# EAGLE schematic Mic to pi entire design without pinouts (EAGLE 9.6.2)
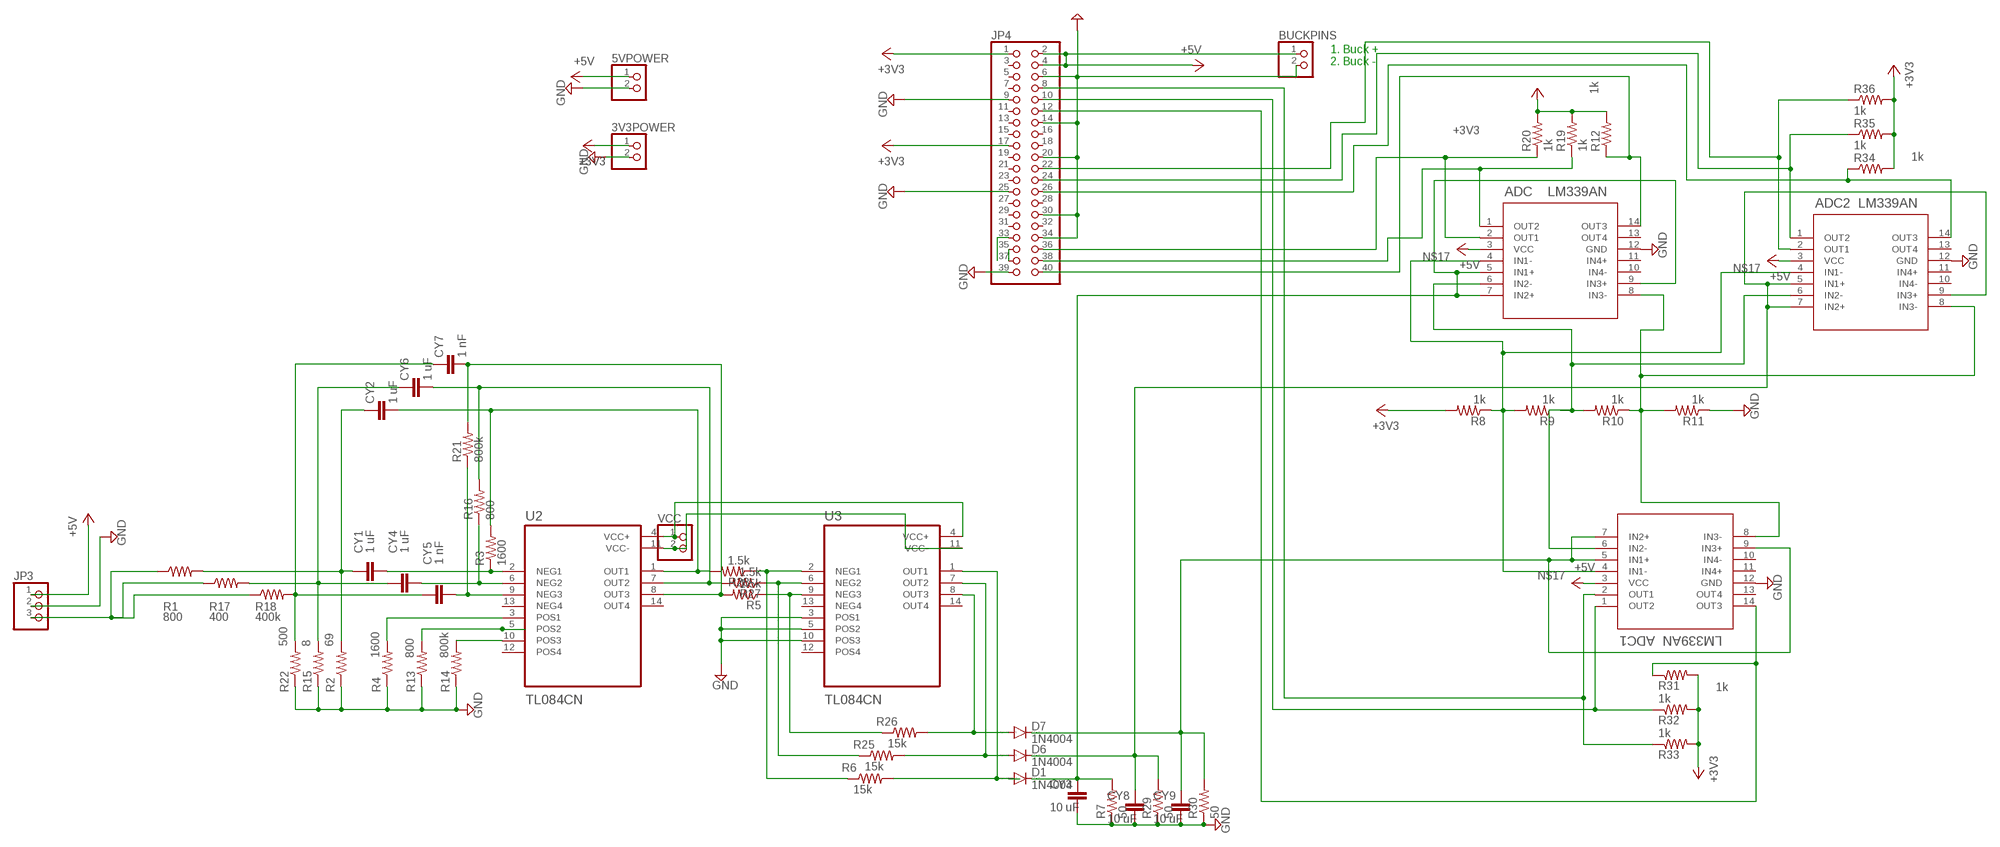
[diagram p0: schematic, sheet 1]

## Parts
3V3POWER  PINHD-1X2  [1X02]
5VPOWER  PINHD-1X2  [1X02]
ADC  LM339AN  [PDIP14_646-06_ONS]
ADC1  LM339AN  [PDIP14_646-06_ONS]
ADC2  LM339AN  [PDIP14_646-06_ONS]
BUCKPINS  PINHD-1X2  [1X02]
CY1  1 uF  CYYC7B5  [YC7B5]
CY2  1 uF  CYYC7B5  [YC7B5]
CY3  10 uF  CYYC7B5  [YC7B5]
CY4  1 uF  CYYC7B5  [YC7B5]
CY5  1 nF  CYYC7B5  [YC7B5]
CY6  1 uF  CYYC7B5  [YC7B5]
CY7  1 nF  CYYC7B5  [YC7B5]
CY8  10 uF  CYYC7B5  [YC7B5]
CY9  10 uF  CYYC7B5  [YC7B5]
D1  1N4004  [DO41-10]
D6  1N4004  [DO41-10]
D7  1N4004  [DO41-10]
JP3  PINHD-1X3  [1X03]
JP4  PINHD-2X20  [2X20]
R1  800  R-US_0204/7  [0204/7]
R2  69  R-US_0204/7  [0204/7]
R3  1600  R-US_0204/7  [0204/7]
R4  1600  R-US_0204/7  [0204/7]
R5  1.5k  R-US_0204/7  [0204/7]
R6  15k  R-US_0204/7  [0204/7]
R7  50  R-US_0204/7  [0204/7]
R8  1k  R-US_0204/7  [0204/7]
R9  1k  R-US_0207/2V  [0207/2V]
R10  1k  R-US_0207/2V  [0207/2V]
R11  1k  R-US_0207/2V  [0207/2V]
R12  1k  R-US_0207/2V  [0207/2V]
R13  800  R-US_0204/7  [0204/7]
R14  800k  R-US_0204/7  [0204/7]
R15  8  R-US_0204/7  [0204/7]
R16  800  R-US_0204/7  [0204/7]
R17  400  R-US_0204/7  [0204/7]
R18  400k  R-US_0204/7  [0204/7]
R19  1k  R-US_0204/7  [0204/7]
R20  1k  R-US_0204/7  [0204/7]
R21  800k  R-US_0204/7  [0204/7]
R22  500  R-US_0204/7  [0204/7]
R25  15k  R-US_0204/7  [0204/7]
R26  15k  R-US_0204/7  [0204/7]
R27  1.5k  R-US_0204/7  [0204/7]
R28  1.5k  R-US_0204/7  [0204/7]
R29  50  R-US_0204/7  [0204/7]
R30  50  R-US_0204/7  [0204/7]
R31  1k  R-US_0207/2V  [0207/2V]
R32  1k  R-US_0204/7  [0204/7]
R33  1k  R-US_0204/7  [0204/7]
R34  1k  R-US_0207/2V  [0207/2V]
R35  1k  R-US_0204/7  [0204/7]
R36  1k  R-US_0204/7  [0204/7]
U2  TL084CN  [DIP794W45P254L1969H508Q14]
U3  TL084CN  [DIP794W45P254L1969H508Q14]
VCC  PINHD-1X2  [1X02]

## Nets
+3V3: 3V3POWER.1 JP4.1 JP4.17 R8.2 R12.2 R19.2 R20.2 R31.2 R32.2 R33.2 R34.2 R35.2 R36.2
+5V: 5VPOWER.1 ADC1.3(VCC) ADC2.3(VCC) ADC.3(VCC) BUCKPINS.1 JP3.1 JP4.2 JP4.4
GND: 3V3POWER.2 5VPOWER.2 ADC1.12(GND) ADC2.12(GND) ADC.12(GND) BUCKPINS.2 CY3.2 CY8.2 CY9.2 JP3.2 JP4.6 JP4.9 JP4.14 JP4.20 JP4.25 JP4.30 JP4.34 JP4.39 R2.1 R4.1 R7.1 R11.1 R13.1 R14.1 R15.1 R22.1 R29.1 R30.1 U3.3(POS1) U3.5(POS2) U3.10(POS3)
N$1: R6.1 R28.1 U3.2(NEG1)
N$2: R13.2 U2.5(POS2)
N$3: R14.2 U2.10(POS3)
N$4: JP3.3 R1.1 R17.1 R18.1
N$5: CY4.1 CY6.1 R15.2 R17.2
N$6: CY5.1 CY7.1 R18.2 R22.2
N$7: CY4.2 R16.1 U2.6(NEG2)
N$8: CY2.2 R3.2 R28.2 U2.1(OUT1)
N$9: CY5.2 R21.1 U2.9(NEG3)
N$10: CY6.2 R16.2 R27.2 U2.7(OUT2)
N$11: CY1.1 CY2.1 R1.2 R2.2
N$12: CY1.2 R3.1 U2.2(NEG1)
N$13: R4.2 U2.3(POS1)
N$14: CY7.2 R5.2 R21.2 U2.8(OUT3)
N$15: ADC.5(IN1+) ADC.7(IN2+) ADC.9(IN3+) CY3.1 D1.C R7.2
N$16: ADC.1(OUT2) JP4.38 R19.1
N$17: ADC1.4(IN1-) ADC2.4(IN1-) ADC.4(IN1-) R8.1 R9.2
N$18: ADC1.6(IN2-) ADC2.6(IN2-) ADC.6(IN2-) R9.1 R10.2
N$19: ADC1.8(IN3-) ADC2.8(IN3-) ADC.8(IN3-) R10.1 R11.2
N$20: ADC.2(OUT1) JP4.36 R20.1
N$21: ADC.14(OUT3) JP4.40 R12.1
N$22: JP4.35 JP4.37
N$23: JP4.33
N$24: R25.1 R27.1 U3.6(NEG2)
N$25: D1.A R6.2 U3.1(OUT1)
N$26: R5.1 R26.1 U3.9(NEG3)
N$27: D7.A R26.2 U3.8(OUT3)
N$43: U2.11(VCC-) U3.11(VCC-) VCC.2
N$44: U2.4(VCC+) U3.4(VCC+) VCC.1
N$45: D6.A R25.2 U3.7(OUT2)
N$50: ADC2.5(IN1+) ADC2.7(IN2+) ADC2.9(IN3+) CY8.1 D6.C R29.2
N$51: ADC1.5(IN1+) ADC1.7(IN2+) ADC1.9(IN3+) CY9.1 D7.C R30.2
N$55: ADC1.1(OUT2) JP4.10 R32.1
N$56: ADC1.14(OUT3) JP4.12 R31.1
N$57: ADC1.2(OUT1) JP4.8 R33.1
N$61: ADC2.1(OUT2) JP4.24 R35.1
N$62: ADC2.14(OUT3) JP4.26 R34.1
N$63: ADC2.2(OUT1) JP4.22 R36.1
Unconnected: ADC1.10(IN4-) ADC1.11(IN4+) ADC1.13(OUT4) ADC2.10(IN4-) ADC2.11(IN4+) ADC2.13(OUT4) ADC.10(IN4-) ADC.11(IN4+) ADC.13(OUT4) JP4.3 JP4.5 JP4.7 JP4.11 JP4.13 JP4.15 JP4.16 JP4.18 JP4.19 JP4.21 JP4.23 JP4.27 JP4.28 JP4.29 JP4.31 JP4.32 U2.12(POS4) U2.13(NEG4) U2.14(OUT4) U3.12(POS4) U3.13(NEG4) U3.14(OUT4)

## Notes on the sheet
- 1. Buck +
  2. Buck -

## Library data of the parts
3V3POWER 5VPOWER BUCKPINS VCC = pinhead:PINHD-1X2: PIN HEADER
ADC ADC1 ADC2 = LM339AN:LM339AN; COPYRIGHT: Copyright (C) 2022 Ultra Librarian. All rights reserved.; DIGI-KEY_PART_NUMBER_1: 2156-LM339AN-HC-ND; DIGI-KEY_PART_NUMBER_2: 2156-LM339AN-ON-ND; DIGI-KEY_PART_NUMBER_3: 296-6605-5-ND; DIGI-KEY_PART_NUMBER_4: 497-1587-5-ND; DIGI-KEY_PART_NUMBER_5: LM339ANFS-ND; MANUFACTURER_PART_NUMBER: LM339AN; MFR_NAME: onsemi
CY1-CY9 = rcl:CY: Y CAPACITOR for power line; SPICEPREFIX: C
D1 D6 D7 = diode:1N4004: DIODE general purpose rectifier, 1 A
JP3 = pinhead:PINHD-1X3: PIN HEADER
JP4 = pinhead:PINHD-2X20: PIN HEADER
R1-R22 R25-R36 = rcl:R-US_: RESISTOR, American symbol; SPICEPREFIX: R
U2 U3 = TL084CN:TL084CN; DESCRIPTION: Quad High Slew Rate JFET-Input Operational Amplifier 14-PDIP 0 to 70; DIGI-KEY_PART_NUMBER: 296-1784-5-ND; MF: Texas Instruments; MP: TL084CN; PACKAGE: PDIP-14 Texas Instruments; PURCHASE-URL: https://pricing.snapeda.com/search/part/TL084CN/?ref=eda